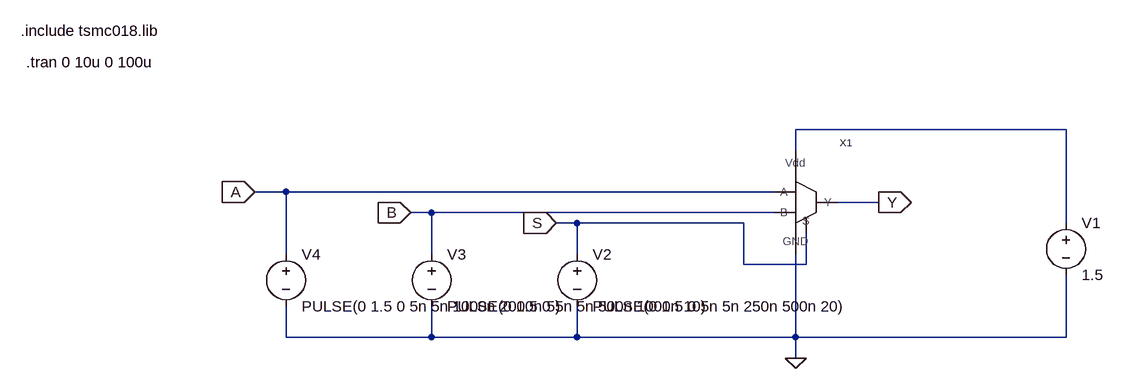
[diagram p0: schematic 2x1_mux_cmos_tb.asc]
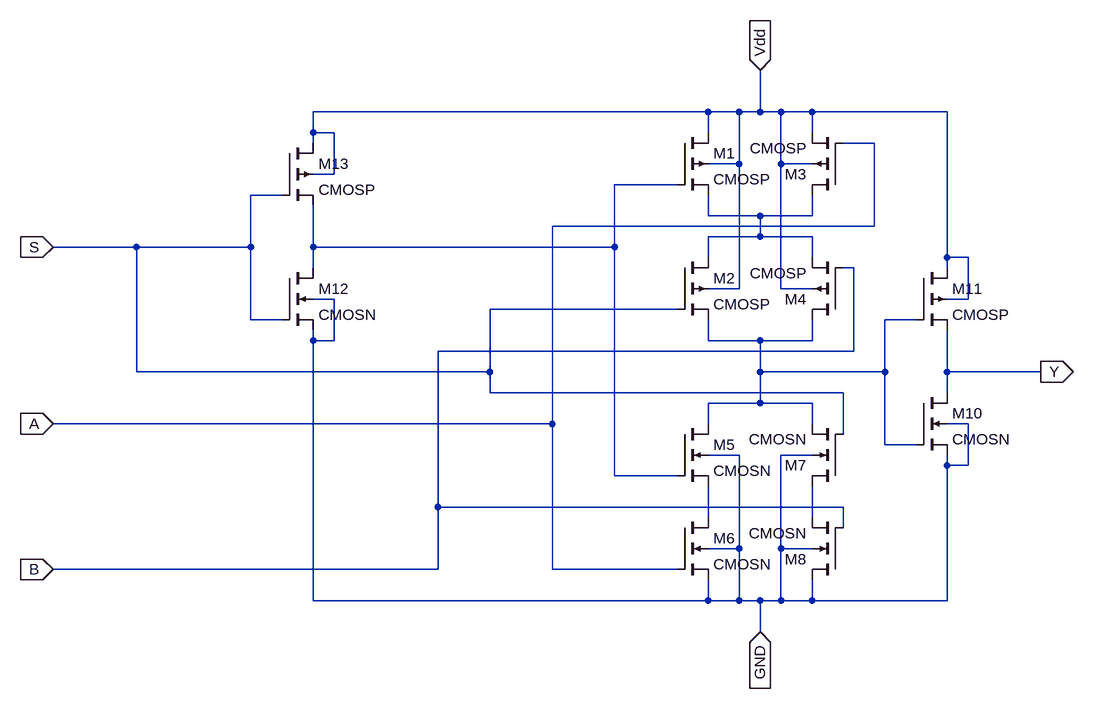
[diagram p1: sub-circuit 2x1_mux_cmos.asc]
2x1_mux_cmos_tb.asc, the LTspice schematic file:
Version 4
SHEET 1 880 680
WIRE 656 64 240 64
WIRE 240 96 240 64
WIRE -544 160 -592 160
WIRE 208 160 -544 160
WIRE 368 176 304 176
WIRE -320 192 -352 192
WIRE 208 192 -320 192
WIRE -96 208 -128 208
WIRE 160 208 -96 208
WIRE 656 208 656 64
WIRE -544 256 -544 160
WIRE -320 256 -320 192
WIRE -96 256 -96 208
WIRE 160 272 160 208
WIRE 256 272 256 224
WIRE 256 272 160 272
WIRE -544 384 -544 336
WIRE -320 384 -320 336
WIRE -320 384 -544 384
WIRE -96 384 -96 336
WIRE -96 384 -320 384
WIRE 240 384 240 256
WIRE 240 384 -96 384
WIRE 656 384 656 288
WIRE 656 384 240 384
WIRE 240 416 240 384
FLAG 240 416 0
FLAG 368 176 Y
IOPIN 368 176 Out
FLAG -592 160 A
IOPIN -592 160 In
FLAG -352 192 B
IOPIN -352 192 In
FLAG -128 208 S
IOPIN -128 208 In
SYMBOL 2x1_mux_cmos 240 144 R0
SYMATTR InstName X1
SYMBOL voltage 656 192 R0
WINDOW 123 0 0 Left 0
WINDOW 39 0 0 Left 0
SYMATTR InstName V1
SYMATTR Value 1.5
SYMBOL voltage -96 240 R0
WINDOW 123 0 0 Left 0
WINDOW 39 0 0 Left 0
SYMATTR InstName V2
SYMATTR Value PULSE(0 1.5 0 5n 5n 250n 500n 20)
SYMBOL voltage -320 240 R0
WINDOW 123 0 0 Left 0
WINDOW 39 0 0 Left 0
SYMATTR InstName V3
SYMATTR Value PULSE(0 1.5 0 5n 5n 500n 1000n 10)
SYMBOL voltage -544 240 R0
WINDOW 123 0 0 Left 0
WINDOW 39 0 0 Left 0
SYMATTR InstName V4
SYMATTR Value PULSE(0 1.5 0 5n 5n 1000n 2000n 5)
TEXT -952 -88 Left 2 !.include tsmc018.lib
TEXT -944 -40 Left 2 !.tran 0 10u 0 100u

2x1_mux_cmos.asc, the sub-circuit schematic file:
Version 4
SHEET 1 880 944
WIRE 160 32 -448 32
WIRE 208 32 160 32
WIRE 240 32 240 -32
WIRE 240 32 208 32
WIRE 272 32 240 32
WIRE 320 32 272 32
WIRE 528 32 320 32
WIRE -448 64 -448 32
WIRE -416 64 -448 64
WIRE 160 64 160 32
WIRE 320 64 320 32
WIRE -448 80 -448 64
WIRE 416 80 368 80
WIRE 208 112 208 32
WIRE 208 112 160 112
WIRE 272 112 272 32
WIRE 320 112 272 112
WIRE -416 128 -416 64
WIRE -416 128 -448 128
WIRE 112 144 16 144
WIRE -496 160 -544 160
WIRE 160 192 160 160
WIRE 240 192 160 192
WIRE 320 192 320 160
WIRE 320 192 240 192
WIRE 416 208 416 80
WIRE 416 208 -80 208
WIRE 240 224 240 192
WIRE 240 224 160 224
WIRE 320 224 240 224
WIRE -720 240 -848 240
WIRE -544 240 -544 160
WIRE -544 240 -720 240
WIRE -448 240 -448 176
WIRE 16 240 16 144
WIRE 16 240 -448 240
WIRE 160 256 160 224
WIRE 320 256 320 224
WIRE 528 256 528 32
WIRE 560 256 528 256
WIRE -448 272 -448 240
WIRE 384 272 368 272
WIRE 528 272 528 256
WIRE 208 304 208 112
WIRE 208 304 160 304
WIRE 272 304 272 112
WIRE 320 304 272 304
WIRE -416 320 -448 320
WIRE 560 320 560 256
WIRE 560 320 528 320
WIRE 112 336 -176 336
WIRE -544 352 -544 240
WIRE -496 352 -544 352
WIRE 480 352 432 352
WIRE -448 384 -448 368
WIRE -416 384 -416 320
WIRE -416 384 -448 384
WIRE 160 384 160 352
WIRE 240 384 160 384
WIRE 320 384 320 352
WIRE 320 384 240 384
WIRE 384 400 384 272
WIRE 384 400 -256 400
WIRE -720 432 -720 240
WIRE -176 432 -176 336
WIRE -176 432 -720 432
WIRE 240 432 240 384
WIRE 432 432 432 352
WIRE 432 432 240 432
WIRE 528 432 528 368
WIRE 672 432 528 432
WIRE -176 464 -176 432
WIRE 368 464 -176 464
WIRE 528 464 528 432
WIRE 240 480 240 432
WIRE 240 480 160 480
WIRE 320 480 240 480
WIRE -80 512 -80 208
WIRE -80 512 -848 512
WIRE 160 512 160 480
WIRE 320 512 320 480
WIRE 560 512 528 512
WIRE 368 528 368 464
WIRE 432 544 432 432
WIRE 480 544 432 544
WIRE 208 560 160 560
WIRE 320 560 272 560
WIRE 528 576 528 560
WIRE 560 576 560 512
WIRE 560 576 528 576
WIRE 16 592 16 240
WIRE 112 592 16 592
WIRE -256 640 -256 400
WIRE 368 640 -256 640
WIRE 160 656 160 608
WIRE 320 656 320 608
WIRE 368 672 368 640
WIRE 208 704 208 560
WIRE 208 704 160 704
WIRE 272 704 272 560
WIRE 320 704 272 704
WIRE -256 736 -256 640
WIRE -256 736 -848 736
WIRE -80 736 -80 512
WIRE 112 736 -80 736
WIRE -448 784 -448 384
WIRE 160 784 160 752
WIRE 160 784 -448 784
WIRE 208 784 208 704
WIRE 208 784 160 784
WIRE 240 784 208 784
WIRE 272 784 272 704
WIRE 272 784 240 784
WIRE 320 784 320 752
WIRE 320 784 272 784
WIRE 528 784 528 576
WIRE 528 784 320 784
WIRE 240 832 240 784
FLAG -848 240 S
IOPIN -848 240 In
FLAG -848 512 A
IOPIN -848 512 In
FLAG -848 736 B
IOPIN -848 736 In
FLAG 240 -32 Vdd
IOPIN 240 -32 In
FLAG 240 832 GND
IOPIN 240 832 In
FLAG 672 432 Y
IOPIN 672 432 Out
SYMBOL cmosp 112 64 R0
SYMATTR InstName M1
SYMATTR Value2 l=180n w=1u
SYMBOL cmosp 112 256 R0
SYMATTR InstName M2
SYMATTR Value2 l=180n w=1u
SYMBOL cmosp 368 160 R180
SYMATTR InstName M3
SYMATTR Value2 l=180n w=1u
SYMBOL cmosp 368 352 R180
SYMATTR InstName M4
SYMATTR Value2 l=180n w=1u
SYMBOL cmosn 112 512 R0
SYMATTR InstName M5
SYMATTR Value2 l=180n w=1u
SYMBOL cmosn 112 656 R0
SYMATTR InstName M6
SYMATTR Value2 l=180n w=1u
SYMBOL cmosn 368 608 R180
SYMATTR InstName M7
SYMATTR Value2 l=180n w=1u
SYMBOL cmosn 368 752 R180
SYMATTR InstName M8
SYMATTR Value2 l=180n w=1u
SYMBOL cmosn 480 464 R0
SYMATTR InstName M10
SYMATTR Value2 l=180n w=1u
SYMBOL cmosn -496 272 R0
SYMATTR InstName M12
SYMATTR Value2 l=180n w=1u
SYMBOL cmosp -496 80 R0
SYMATTR InstName M13
SYMATTR Value2 l=180n w=1u
SYMBOL cmosp 480 272 R0
SYMATTR InstName M11
SYMATTR Value2 l=180n w=1u

The netlist it stands for:
* 2x1_mux_cmos_tb.asc
XX1 Y 0 S N001 A B 2x1_mux_cmos
V1 N001 0 1.5
V2 S 0 PULSE(0 1.5 0 5n 5n 250n 500n 20)
V3 B 0 PULSE(0 1.5 0 5n 5n 500n 1000n 10)
V4 A 0 PULSE(0 1.5 0 5n 5n 1000n 2000n 5)

* block symbol definitions
.subckt 2x1_mux_cmos Y GND S Vdd A B
M1 Vdd N001 N002 Vdd CMOSP l=180n w=1u
M2 N002 S N003 Vdd CMOSP l=180n w=1u
M3 N002 A Vdd Vdd CMOSP l=180n w=1u
M4 N003 B N002 Vdd CMOSP l=180n w=1u
M5 N003 N001 N004 GND CMOSN l=180n w=1u
M6 N004 A GND GND CMOSN l=180n w=1u
M7 N005 S N003 GND CMOSN l=180n w=1u
M8 GND B N005 GND CMOSN l=180n w=1u
M10 Y N003 GND GND CMOSN l=180n w=1u
M12 N001 S GND GND CMOSN l=180n w=1u
M13 Vdd S N001 Vdd CMOSP l=180n w=1u
M11 Vdd N003 Y Vdd CMOSP l=180n w=1u
.ends 2x1_mux_cmos

.model NMOS NMOS
.model PMOS PMOS
.lib standard.mos
.include tsmc018.lib
.tran 0 10u 0 100u
.backanno
.end